# EAGLE design MHI-AC-Ctrl_v1.0 (EAGLE 9.5.2)
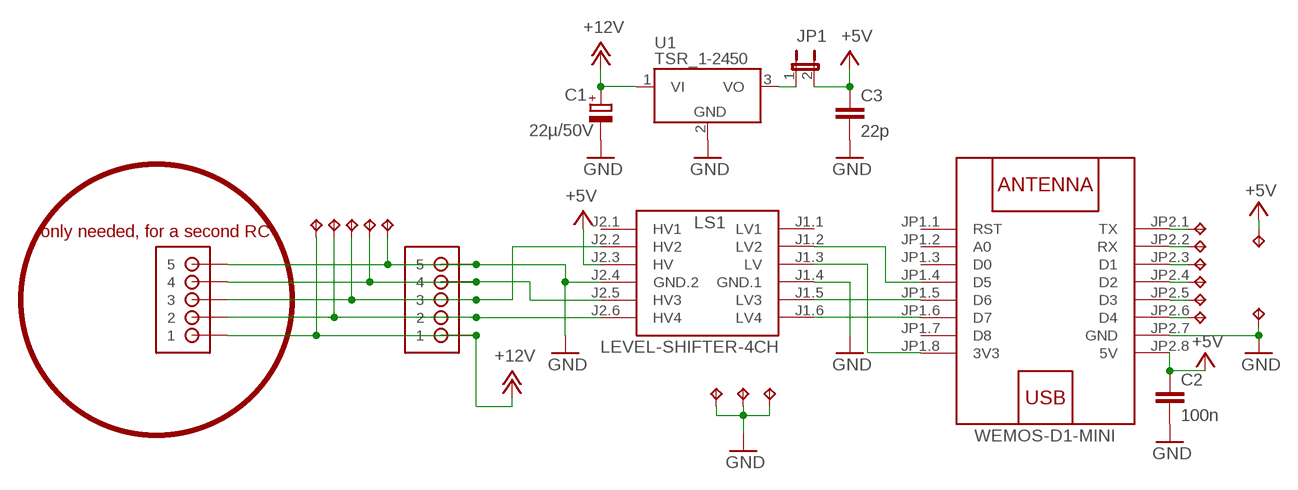
[diagram p0: schematic, sheet 1]

## Parts
C1  22µ/50V  CPOL-EUE5-10.5  [E5-10,5]
C2  100n  C-EU025-024X044  [C025-024X044]
C3  22p  C-EU025-024X044  [C025-024X044]
JP1  JP1E  [JP1]
LS1  LEVEL-SHIFTER-4CH  [LEVEL-SHIFTER-4CH]
TP1  TPPAD1-13  [P1-13]
TP2  TPPAD1-13  [P1-13]
TP3  TPPAD1-13  [P1-13]
TP4  TPPAD1-13  [P1-13]
TP5  TPPAD1-13  [P1-13]
TP6  TPPAD1-13  [P1-13]
TP7  TPPAD1-13  [P1-13]
TP8  TPPAD1-13  [P1-13]
TP9  TPPAD1-13  [P1-13]
TP10  TPPAD1-13  [P1-13]
TP11  TPPAD1-13  [P1-13]
TP12  TPPAD1-13  [P1-13]
TP13  TPPAD1-13  [P1-13]
TP14  TPPAD1-13  [P1-13]
TP15  TPPAD1-13  [P1-13]
TP16  TPPAD1-13  [P1-13]
U1  TSR_1-2450  TSR_1-24_  [TSR-1]
U$1  WEMOS-D1-MINI  [WEMOS-D1-MINI]
U$4  JST-PH_5-PIN_HEADER  [JST_B5B-PH_HEADER]
U$5  JST-PH_5-PIN_HEADER  [JST_B5B-PH_HEADER]

## Nets
+3V3: LS1.J1.3(LV) U$1.JP1.8(3V3)
+5V: C2.1 C3.1 JP1.2 LS1.J2.3(HV) TP8.TP U$1.JP2.8(5V)
+12V: C1.+ TP13.TP U1.1(VI) U$4.P1 U$5.P1
GND: C1.- C2.2 C3.2 LS1.J1.4(GND.1) LS1.J2.4(GND.2) TP7.TP TP9.TP TP14.TP TP15.TP TP16.TP U1.2(GND) U$1.JP2.7(GND) U$4.P5 U$5.P5
MISO: LS1.J2.5(HV3) TP10.TP U$4.P4 U$5.P4
MISO_LV: LS1.J1.5(LV3) U$1.JP1.5(D6)
MOSI: LS1.J2.6(HV4) TP12.TP U$4.P2 U$5.P2
MOSI_LV: LS1.J1.6(LV4) U$1.JP1.6(D7)
N$9: TP1.TP U$1.JP2.1(TX)
N$10: TP2.TP U$1.JP2.2(RX)
N$11: TP3.TP U$1.JP2.3(D1)
N$12: TP4.TP U$1.JP2.4(D2)
N$13: TP5.TP U$1.JP2.5(D3)
N$14: TP6.TP U$1.JP2.6(D4)
N$86: JP1.1 U1.3(VO)
SCL: LS1.J2.2(HV2) TP11.TP U$4.P3 U$5.P3
SCL_LV: LS1.J1.2(LV2) U$1.JP1.4(D5)
Unconnected: LS1.J1.1(LV1) LS1.J2.1(HV1) U$1.JP1.1(RST) U$1.JP1.2(A0) U$1.JP1.3(D0) U$1.JP1.7(D8)

## Notes on the sheet
- only needed, for a second RC

## Library data of the parts
C1 = rcl:CPOL-EU: POLARIZED CAPACITOR, European symbol; SPICEPREFIX: C
C2 C3 = rcl:C-EU: CAPACITOR, European symbol; SPICEPREFIX: C
JP1 = jumper:JP1E: JUMPER
LS1 = diy-modules:LEVEL-SHIFTER-4CH: 4-Channel Bi-Directional Logic Level Converter based on BSS128 transistors Click here to find device on ebay.com <http://www.ebay.com/sch/i2c+logic+converter+module>
TP1-TP16 = testpad:TP: Test pad
U1 = _traco_tsr-1:TSR_1-*: TRACO TSR-1 Series Point-of-Load DC/DC-Converters Vi max. 36 V; Vo = (1.2 .. 15)V ±2%; Io = 0 .. 1 A SIP-Package (drop-in replacement for 78xx linear voltage regulators in TO220-package, vertically assembled) Source: www.tracopower.com Technologies: TSR 1- Vi (V) Vo (V) ±2% Io = 0 .. 1 A 24_ ( generic ) 2412 4.6 .. 36 1.2 2415 4.6 .. 36 1.5 2418 4.6 .. 36 1.8 2425 4.6 .. 36 2.5 2433 4.75.. 36 3.3 2450 6.5 .. 36 5.0 2465 9.0 .. 36 6.5 2490 12 .. 36 9.0 24120 15 .. 36 12 24150 18 .. 36 15 Author: Dipl.-Ing. FH Rainer Bayer HHN Hochschule Heilbronn, rainer.bayer@hs-heilbronn.de Ingenieurbüro ing-rb, mail@ing-rb.de
U$1 = diy-modules:WEMOS-D1-MINI: WEMOS D1 mini: Mini Wi-Fi Board based on ESP-8266 device More details can be found here: https://www.wemos.cc/product/d1-mini.html Click here to find device on ebay.com <http://www.ebay.com/sch/wemos+d1+mini+nodemcu>
U$4 U$5 = srg:JST-PH_5-PIN_HEADER: 5-pin JST PH Shrouded Header, top entry P/N B5B-PH-K-S Mating connector PHR-5 Mating cable assembly: Sparkfun PRT-09917 <http://www.sparkfun.com/products/9917>

## Board
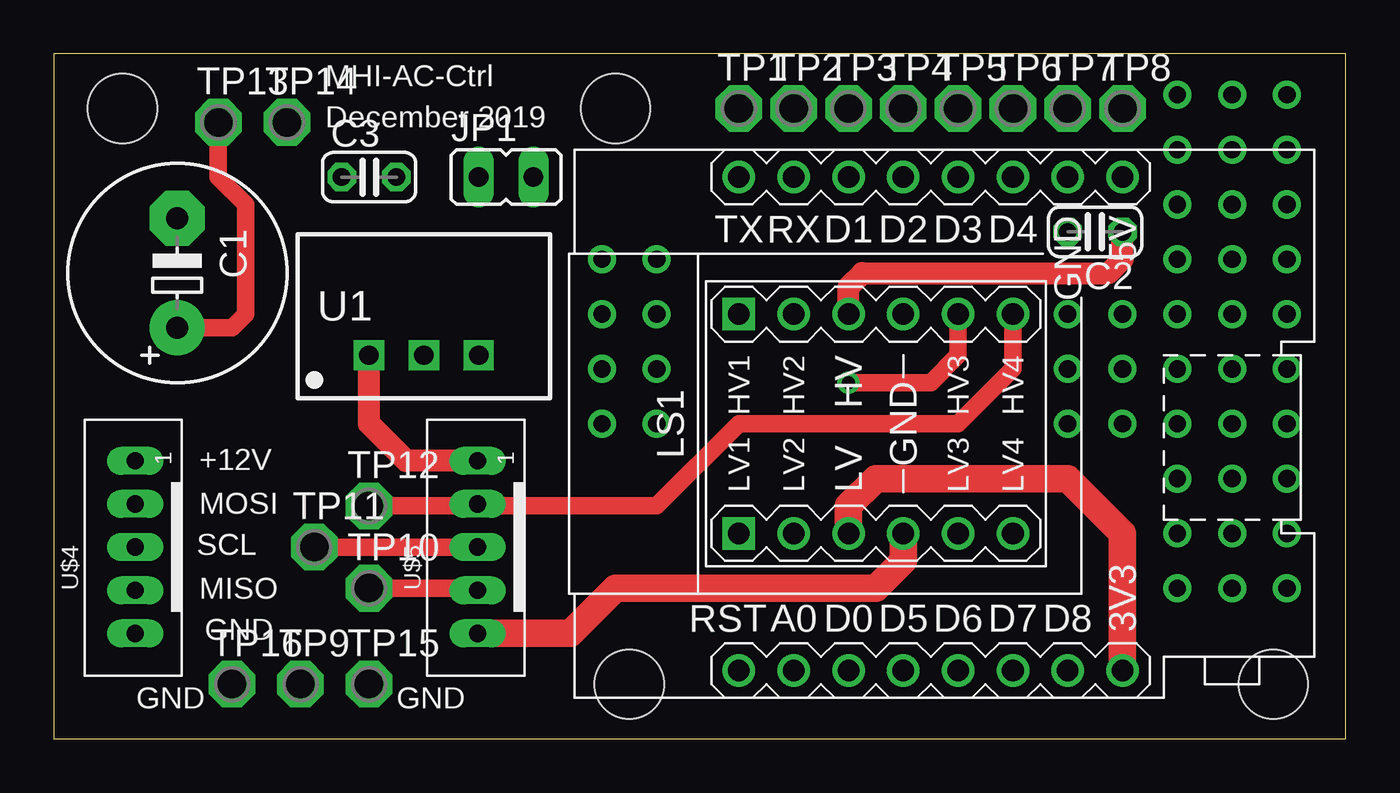
[diagram p1: board, top side]
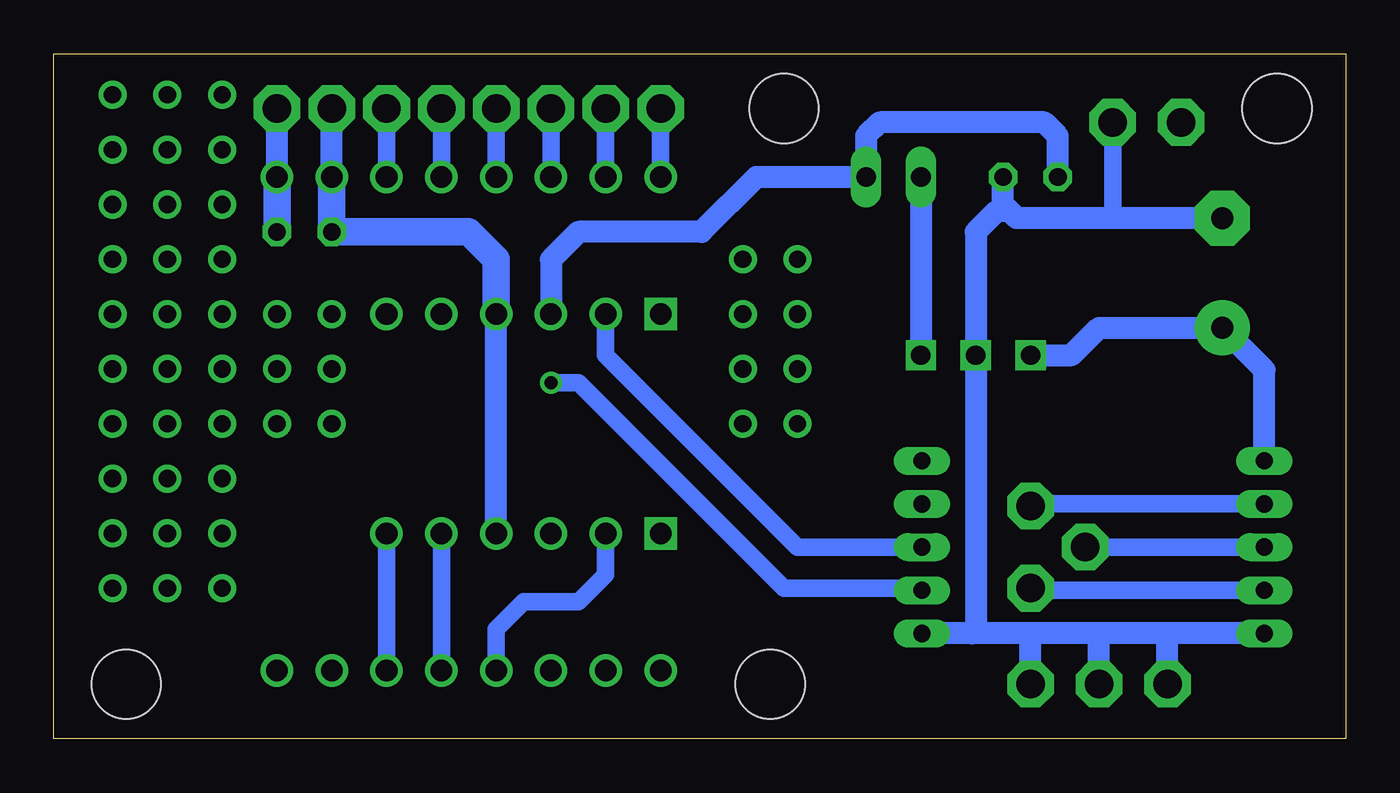
[diagram p2: board, bottom side, seen from below]

Size 59.87 x 31.74 mm. Coordinates in mm from the lower left corner, seen from the top.
Outline: 0,0 59.87,0 59.87,31.74 0,31.74 0,0
Copper layers (1*16): Top 0.035mm / dielectric 1.5mm / Bottom 0.035mm
Design rules "default": minimum track width 6mil, minimum drill 0.35mm, track to track 6mil, track to pad 6mil, pad to pad 6mil, via to via 6mil, smd to smd 6mil, copper to edge 40mil, drill to drill 6mil, minimum pad ring 10mil, minimum via ring 8mil, stop-mask expansion 4mil, vias tented up to drill 0mil, thermal gap 10mil
Holes 3.2 mm at 56.52,2.54 26.67,2.54 26.04,29.21 3.17,29.21

### Footprints (pad centres in the part's own frame; a part is rotated, then mirrored left to right if it is on the bottom)
E5-10,5 = drill 1.016 pad 2.54: + -2.54,0 | drill 1.016 pad 2.54 octagon: - 2.54,0
C025-024X044 = drill 0.813 octagon: 1 -1.27,0; 2 1.27,0
JP1 = drill 0.914 long: 1 0,-1.27; 2 0,1.27
LEVEL-SHIFTER-4CH = drill 1 square: J1.1 -5.08,6.35; J2.1 5.08,6.35 | drill 1: J1.2 -5.08,3.81; J1.3 -5.08,1.27; J1.4 -5.08,-1.27; J1.5 -5.08,-3.81; J1.6 -5.08,-6.35; J2.2 5.08,3.81; J2.3 5.08,1.27; J2.4 5.08,-1.27; J2.5 5.08,-3.81; J2.6 5.08,-6.35
P1-13 = drill 1.321 pad 2.159 octagon: TP 0,0
TSR-1 = drill 0.9 square: 1 -2.54,0; 2 0,0; 3 2.54,0
WEMOS-D1-MINI = drill 1: JP1.1 -11.43,9.525; JP1.2 -11.43,6.985; JP1.3 -11.43,4.445; JP1.4 -11.43,1.905; JP1.5 -11.43,-0.635; JP1.6 -11.43,-3.175; JP1.7 -11.43,-5.715; JP1.8 -11.43,-8.255; JP2.1 11.43,9.525; JP2.2 11.43,6.985; JP2.3 11.43,4.445; JP2.4 11.43,1.905; JP2.5 11.43,-0.635; JP2.6 11.43,-3.175; JP2.7 11.43,-5.715; JP2.8 11.43,-8.255
JST_B5B-PH_HEADER = drill 0.8 long: P1 4,0.048; P2 2,0.048; P3 0,0.048; P4 -2,0.048; P5 -4,0.048

### Placement (x,y rotation side)
C1  5.71,21.59 90 top
C2  48.26,23.5 180 top
C3  14.61,26.04 0 top
JP1  20.95,26.04 270 top
LS1  38.1,14.61 90 top
TP1  31.75,29.21 0 top
TP2  34.29,29.21 0 top
TP3  36.83,29.21 0 top
TP4  39.37,29.21 0 top
TP5  41.91,29.21 0 top
TP6  44.45,29.21 0 top
TP7  46.99,29.21 0 top
TP8  49.53,29.21 0 top
TP9  11.43,2.54 0 top
TP10  14.61,6.99 0 top
TP11  12.06,8.89 0 top
TP12  14.61,10.79 0 top
TP13  7.62,28.57 0 top
TP14  10.79,28.57 0 top
TP15  14.61,2.54 0 top
TP16  8.26,2.54 0 top
U1  17.14,17.78 0 top
U$1  41.27,14.61 90 top
U$4  3.81,8.89 90 top
U$5  19.68,8.89 90 top

### Tracks (layer width: path | path; a pad name or v marks a point on that pad's centre or on a via)
+3V3
  Top 1.27: U$1.JP1.8 49.53,9.53 46.99,12.06 38.1,12.06 36.83,10.79 LS1.J1.3
+5V
  Top 1.016: LS1.J2.3 36.83,20.95 37.47,21.59 48.9,21.59 49.53,22.23 C2.1
  Bottom 1.016: LS1.J2.3 36.83,22.23 35.56,23.5 29.84,23.5 27.3,26.04 JP1.2 22.23,27.94 21.59,28.57 13.97,28.57 13.34,27.94 C3.1 | U$1.JP2.8 TP8.TP
  Bottom 1.27: U$1.JP2.8 C2.1
+12V
  Top 0.813: TP13.TP 7.62,26.04 8.89,24.77 8.89,19.68 8.26,19.05 C1.+
  Top 1.016: U$5.P1 16.32,12.89 14.61,14.61 U1.1
  Bottom 1.016: U1.1 12.7,17.78 11.43,19.05 C1.+ 3.76,17.1 U$4.P1
GND
  Top 1.27: U$5.P5 23.94,4.89 26.04,6.99 38.1,6.99 39.37,8.26 LS1.J1.4
  Bottom 0.813: TP14.TP 10.79,24.13
  Bottom 1.016: LS1.J1.4 LS1.J2.4 | C1.- 10.79,24.13 15.24,24.13 15.56,24.45 | 15.56,24.45 15.88,24.77 C3.2 | 15.56,24.45 16.19,24.45 17.14,23.5 U1.2 17.14,5.08 17.34,4.89 U$5.P5 14.61,4.89 | U$1.JP2.7 TP7.TP | U$4.P5 8.26,4.89 | 8.26,4.89 11.43,4.89 | 11.43,4.89 14.61,4.89 | TP16.TP 8.26,4.89 | TP9.TP 11.43,4.89 | TP15.TP 14.61,4.89
  Bottom 1.27: U$1.JP2.7 C2.2 40.64,23.5 39.37,22.23 LS1.J2.4
MISO  (via drill 0.6)
  Top 0.813: LS1.J2.5 41.91,17.78 40.64,16.51 v36.83,16.51 | TP10.TP 19.54,6.99 U$5.P4
  Bottom 0.813: U$5.P4 19.73,6.99 26.04,6.99 35.56,16.51 v36.83,16.51 | U$4.P4 14.51,6.89 TP10.TP
MISO_LV
  Bottom 0.813: LS1.J1.5 U$1.JP1.5
MOSI
  Top 0.508: 19.54,10.79 U$5.P2
  Top 0.813: LS1.J2.6 44.45,17.14 41.91,14.61 31.75,14.61 27.94,10.79 19.73,10.79 U$5.P2 | 14.51,10.89 TP12.TP 19.54,10.79
  Bottom 0.813: U$4.P2 14.51,10.89 TP12.TP
MOSI_LV
  Bottom 0.813: LS1.J1.6 U$1.JP1.6
N$1  (via drill 0.8 pad 1.3)
  other vias: 46.99,19.68
N$2  (via drill 0.8 pad 1.3)
  other vias: 49.53,19.68
N$3  (via drill 0.8 pad 1.3)
  other vias: 46.99,17.14
N$4  (via drill 0.8 pad 1.3)
  other vias: 49.53,17.14
N$5  (via drill 0.8 pad 1.3)
  other vias: 52.07,19.68
N$6  (via drill 0.8 pad 1.3)
  other vias: 52.07,17.14
N$7  (via drill 0.8 pad 1.3)
  other vias: 54.61,19.68
N$8  (via drill 0.8 pad 1.3)
  other vias: 54.61,17.14
N$9
  Bottom 0.813: U$1.JP2.1 TP1.TP
N$10
  Bottom 0.813: U$1.JP2.2 TP2.TP
N$11
  Bottom 0.813: U$1.JP2.3 TP3.TP
N$12
  Bottom 0.813: U$1.JP2.4 TP4.TP
N$13
  Bottom 0.813: U$1.JP2.5 TP5.TP
N$14
  Bottom 0.813: U$1.JP2.6 TP6.TP
N$15  (via drill 0.8 pad 1.3)
  other vias: 46.99,14.61
N$16  (via drill 0.8 pad 1.3)
  other vias: 49.53,14.61
N$17  (via drill 0.8 pad 1.3)
  other vias: 52.07,14.61
N$18  (via drill 0.8 pad 1.3)
  other vias: 54.61,14.61
N$19  (via drill 0.8 pad 1.3)
  other vias: 52.07,24.77
N$20  (via drill 0.8 pad 1.3)
  other vias: 52.07,22.23
N$21  (via drill 0.8 pad 1.3)
  other vias: 54.61,24.77
N$22  (via drill 0.8 pad 1.3)
  other vias: 54.61,22.23
N$23  (via drill 0.8 pad 1.3)
  other vias: 52.07,29.84
N$24  (via drill 0.8 pad 1.3)
  other vias: 52.07,27.3
N$25  (via drill 0.8 pad 1.3)
  other vias: 54.61,29.84
N$26  (via drill 0.8 pad 1.3)
  other vias: 54.61,27.3
N$27  (via drill 0.8 pad 1.3)
  other vias: 57.15,19.68
N$28  (via drill 0.8 pad 1.3)
  other vias: 57.15,17.14
N$29  (via drill 0.8 pad 1.3)
  other vias: 25.4,22.23
N$30  (via drill 0.8 pad 1.3)
  other vias: 25.4,19.68
N$31  (via drill 0.8 pad 1.3)
  other vias: 57.15,14.61
N$32  (via drill 0.8 pad 1.3)
  other vias: 27.94,22.23
N$33  (via drill 0.8 pad 1.3)
  other vias: 57.15,24.77
N$34  (via drill 0.8 pad 1.3)
  other vias: 57.15,22.23
N$35  (via drill 0.8 pad 1.3)
  other vias: 27.94,19.68
N$36  (via drill 0.8 pad 1.3)
  other vias: 25.4,17.14
N$37  (via drill 0.8 pad 1.3)
  other vias: 57.15,29.84
N$38  (via drill 0.8 pad 1.3)
  other vias: 57.15,27.3
N$39  (via drill 0.8 pad 1.3)
  other vias: 25.4,14.61
N$40  (via drill 0.8 pad 1.3)
  other vias: 27.94,17.14
N$41  (via drill 0.8 pad 1.3)
  other vias: 27.94,14.61
N$42  (via drill 0.8 pad 1.3)
  other vias: 52.07,9.53
N$43  (via drill 0.8 pad 1.3)
  other vias: 52.07,6.99
N$44  (via drill 0.8 pad 1.3)
  other vias: 54.61,9.53
N$45  (via drill 0.8 pad 1.3)
  other vias: 54.61,6.99
N$48  (via drill 0.8 pad 1.3)
  other vias: 52.07,12.06
N$49  (via drill 0.8 pad 1.3)
  other vias: 54.61,12.06
N$50  (via drill 0.8 pad 1.3)
  other vias: 57.15,9.53
N$51  (via drill 0.8 pad 1.3)
  other vias: 57.15,6.99
N$53  (via drill 0.8 pad 1.3)
  other vias: 57.15,12.06
N$86
  Bottom 1.016: JP1.1 U1.3
SCL
  Top 0.813: TP11.TP U$5.P3
  Bottom 0.813: U$5.P3 25.4,8.89 34.29,17.78 LS1.J2.2 | U$4.P3 TP11.TP
SCL_LV
  Bottom 0.813: LS1.J1.2 34.29,7.62 35.56,6.35 38.1,6.35 39.37,5.08 U$1.JP1.4

### Text on the board
tPlace: MHI-AC-Ctrl | December 2019 | +12V | MOSI | SCL | MISO | GND | GND | GND